# Altium project PAY_IF.PrjPcb (part 3 of 3)

## Sheet RS422.SchDoc
size 420 x 297 mm; SheetNumber: 21; SheetTotal: 23
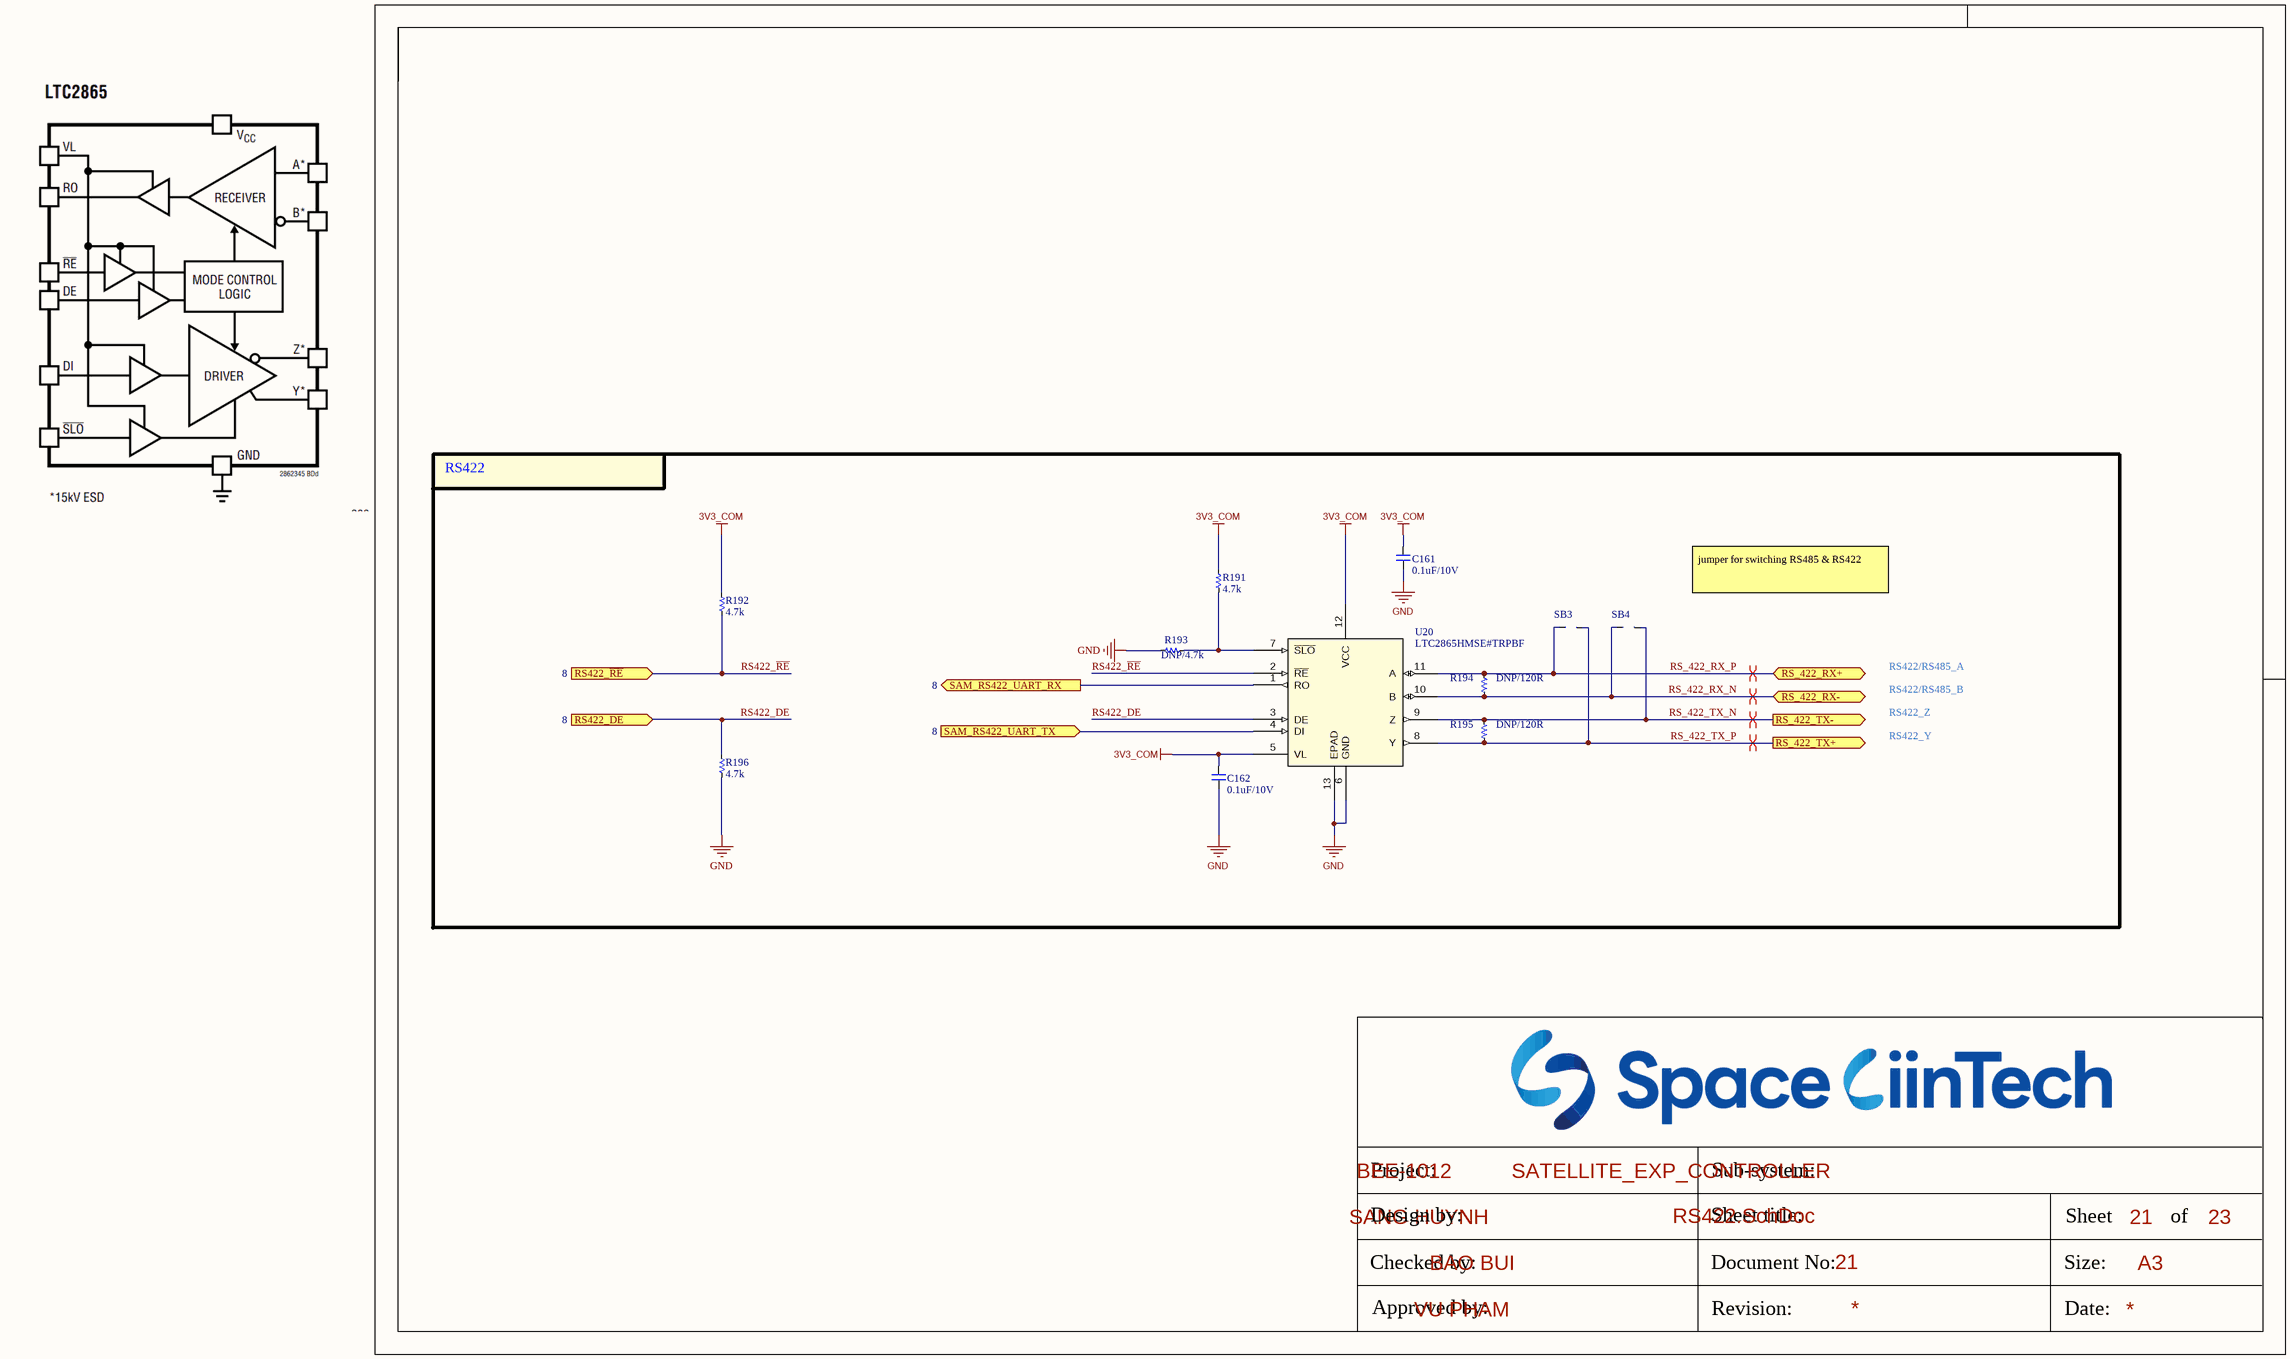
[diagram p24: RS422.SchDoc]

### Parts
C161  0.1uF/10V  [CAP_C_1005X50_L]
C162  0.1uF/10V  [CAP_C_1005X50_L]
R191  4.7k  [RES_C_1005x30_L]
R192  4.7k  [RES_C_1005x30_L]
R193  DNP/4.7k  [RES_C_1005x30_L]
R194  DNP/120R  [RES_C_1005x30_L]
R195  DNP/120R  [RES_C_1005x30_L]
R196  4.7k  [RES_C_1005x30_L]
SB3  JUMPER  [JUMPER_1608]  (value not drawn)
SB4  JUMPER  [JUMPER_1608]  (value not drawn)
U20  LTC2865HMSE#TRPBF  [MSOP-12_MSE_LIT]

### Ports
RS422_DE (in, see 8), RS422_~{RE} (in, see 8), RS_422_RX+ (bidir, see 5), RS_422_RX- (bidir, see 5), RS_422_TX+ (out, see 5), RS_422_TX- (out, see 5), SAM_RS422_UART_RX (out, see 8), SAM_RS422_UART_TX (in, see 8)

### Nets
3V3_COM: C161.2 C162.2 R191.2 R192.2 U20.5(VL) U20.12(VCC)
GND: C161.1 C162.1 R193.2 R196.1 U20.6(GND) U20.13(EPAD)
FLEXCOM3_UART_RX: U20.1(RO) ; port SAM_RS422_UART_RX
FLEXCOM3_UART_TX: U20.4(DI) ; port SAM_RS422_UART_TX
RS422_DE: R196.2 U20.3(DE) ; port RS422_DE
RS422_~{RE}: R192.1 U20.2(~{RE}) ; port RS422_~{RE}
RS_422_RX_N: R194.2 SB4.1 U20.10(B) ; port RS_422_RX-
RS_422_RX_P: R194.1 SB3.1 U20.11(A) ; port RS_422_RX+
RS_422_TX_N: R195.1 SB4.2 U20.9(Z) ; port RS_422_TX-
RS_422_TX_P: R195.2 SB3.2 U20.8(Y) ; port RS_422_TX+
NetR191_1: R191.1 R193.1 U20.7(~{SLO})

### Layout directives
differential pair: RS_422_RX_N, RS_422_RX_P, RS_422_TX_N, RS_422_TX_P

### Notes on the sheet
- RS422
- jumper for switching RS485 & RS422
- RS422/RS485_A
- RS422/RS485_B
- RS422_Z
- RS422_Y
- Project:
- BEE-1012
- Sub-system:
- SATELLITE_EXP_CONTROLLER
- Design by:
- SANG HUYNH
- BAO BUI
- Sheet title:
- Sheet
- A3
- of
- Checked by:
- Approved by:
- VU PHAM
- Revision:
- Document No:
- Size:
- Date:

### Library data of the parts
C161 C162 = _CAP_C_2: CAP CHIP
R191-R196 = _RES_B_2: RES
U20 = LTC2865HMSETRPBF: Â±60V Fault Protected 3V to 5.5V RS485/RS422 Transceivers; Manufacturer_Name: Analog Devices Inc; Copyright: Copyright (C) 2025 Ultra Librarian. All rights reserved.; Manufacturer_Part_Number: LTC2865HMSE#TRPBF; RefDes: RefDes; Type: Type

## Sheet BUTTON_LED.SchDoc
size 420 x 297 mm; SheetNumber: 22; SheetTotal: 23
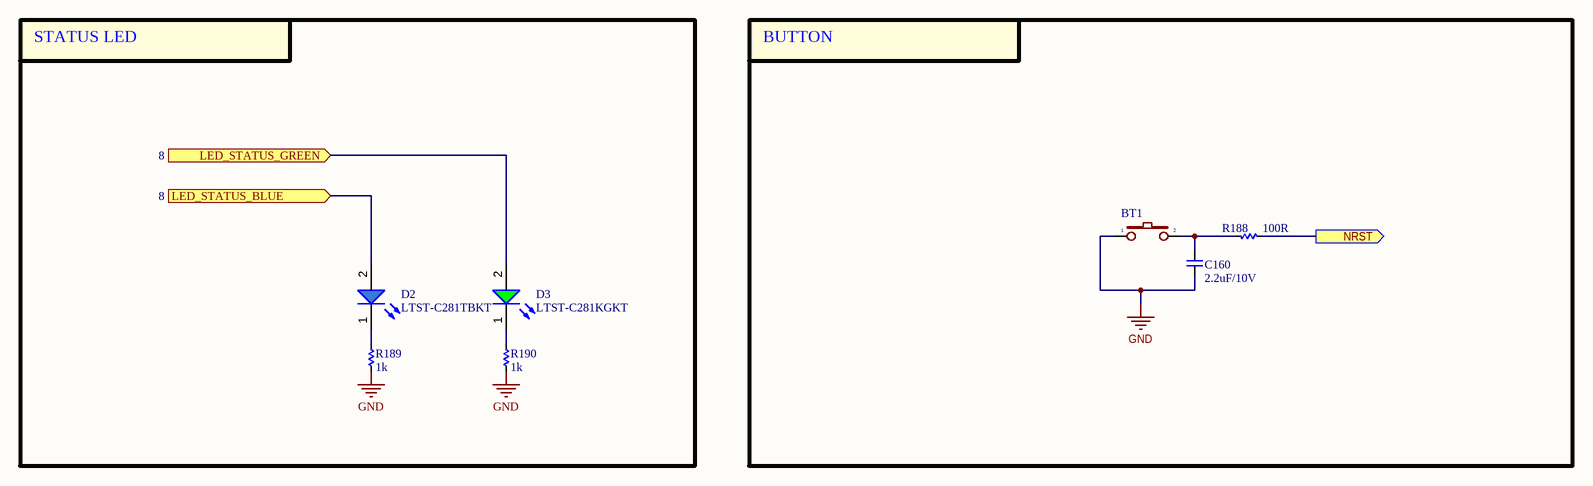
[diagram p25: BUTTON_LED.SchDoc]

### Parts
BT1  BT_  [SW2-SMD]  (value not drawn)
C160  2.2uF/10V  [CAP_C_1005X50_L]
D2  LTST-C281TBKT  [LED_0402]
D3  LTST-C281KGKT  [LED_0402]
R188  100R  [RES_C_1005x30_L]
R189  1k  [RES_C_1005x30_L]
R190  1k  [RES_C_1005x30_L]

### Blocks framed on the sheet
STATUS LED: D2 D3 R189 R190
BUTTON: BT1 C160 R188

### Ports
LED_STATUS_BLUE (in, see 8), LED_STATUS_GREEN (in, see 8), NRST (out, see 6, 7, 17)

### Nets
GND: BT1.1 C160.1 R189.1 R190.1
NRST: R188.2 ; port NRST
NetBT1_2: BT1.2 C160.2 R188.1
NetD2_1: D2.1(K) R189.2
NetD2_2: D2.2(A) ; port LED_STATUS_BLUE
NetD3_1: D3.1(K) R190.2
NetD3_2: D3.2(A) ; port LED_STATUS_GREEN

### Notes on the sheet
- Project:
- BEE-1012
- Sub-system:
- SATELLITE_EXP_CONTROLLER
- Design by:
- SANG HUYNH
- BAO BUI
- Sheet title:
- Sheet
- A3
- of
- Checked by:
- Approved by:
- VU PHAM
- Revision:
- Document No:
- Size:
- Date:

### Library data of the parts
BT1 = BT2: Switch button 2 pin; Value: SW chip 2 pin
C160 = _CAP_C_2: CAP CHIP
D2 = LED_BLUE
D3 = LED_GREEN: LED GREEN CLEAR 0402 SMD
R188-R190 = _RES_B_2: RES

## Sheet MOUNTING_HOLE.SchDoc
size 420 x 297 mm; SheetNumber: 23; SheetTotal: 23
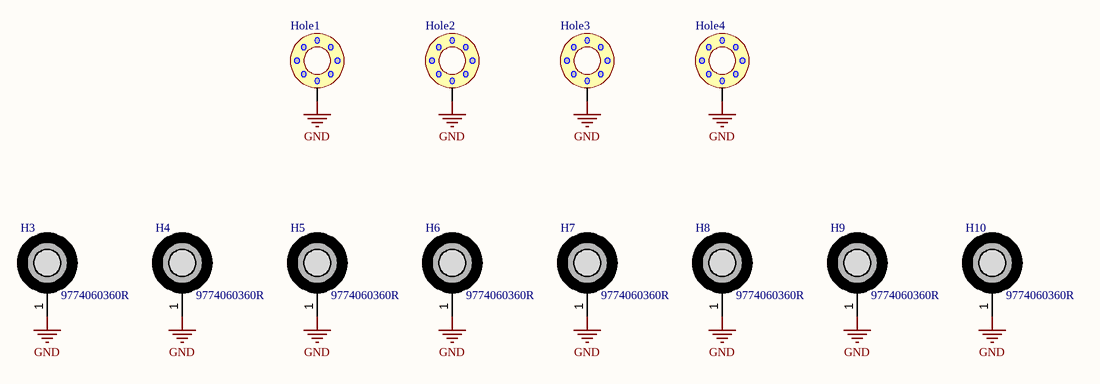
[diagram p26: MOUNTING_HOLE.SchDoc]

### Parts
H3  9774060360R  [M4.4]
H4  9774060360R  [M4.4]
H5  9774060360R  [M4.4]
H6  9774060360R  [M4.4]
H7  9774060360R  [M4.4]
H8  9774060360R  [M4.4]
H9  9774060360R  [M4.4]
H10  9774060360R  [M4.4]
Hole1  hole_space  [HEX-M3_NoVia]  (value not drawn)
Hole2  hole_space  [HEX-M3_NoVia]  (value not drawn)
Hole3  hole_space  [HEX-M3_NoVia]  (value not drawn)
Hole4  hole_space  [HEX-M3_NoVia]  (value not drawn)

### Nets
GND: H3.1 H4.1 H5.1 H6.1 H7.1 H8.1 H9.1 H10.1 Hole1.1 Hole2.1 Hole3.1 Hole4.1

### Notes on the sheet
- Project:
- BEE-1012
- Sub-system:
- SATELLITE_EXP_CONTROLLER
- Design by:
- SANG HUYNH
- BAO BUI
- Sheet title:
- Sheet
- A3
- of
- Checked by:
- Approved by:
- VU PHAM
- Revision:
- Document No:
- Size:
- Date:

### Library data of the parts
H3-H10 = M4.4: WA-SMSI SMT Steel Spacer with / internal Thread

## Nets that join several sheets
3.3_VBAT: Power (C176.1 J11#1.1), SAMA7D65_MPU (R28.1), RTC (C144.2 U12.9)
3V3: SAMA7D65_PMIC (14 pins), SAMA7D65_MPU (19 pins), SAMA7D65_PIO (6 pins), SDCARD (14 pins), EEPROM (C134.2 C135.2 R157.1 U7.8), USB_SWITCH (C163.2 C164.2 R197.2 U21.4), DEBUG_CONSOLE (C136.2 J10.1 R159.1 R160.1), TEMP (C137.2 U9.1), RTC (7 pins), WATCHDOG (C145.2 U13.1)
3V3_COM: Power (C178.2 R212.2 VR1.2 VR1.4), CONNECTOR_INTERFACE (7 pins), LVDS (12 pins), CAN_PHY (6 pins), RS422 (6 pins)
3V3_eMMC: Power (C179.2 R213.2 VR2.2 VR2.4), SAMA7D65_MPU (C45.2 C46.2 U3#2.F9 U3#2.W17), eMMC (72 pins)
5V: Power (10 pins), SAMA7D65_PMIC (13 pins)
12V_CONN: Power (8 pins), CONNECTOR_EXP (J2-2.1 J2-2.2 J2-2.3)
GND: Power (36 pins), CONNECTOR_EXP (7 pins), CONNECTOR_INTERFACE (27 pins), SAMA7D65_PMIC (27 pins), SAMA7D65_MPU (99 pins), SAMA7D65_PIO (C139.1 J2.3 R124.2), SAMA7D65_DDR3L (85 pins), SDCARD (11 pins), eMMC (60 pins), EEPROM (C134.1 C135.1 U7.4), USB_SWITCH (6 pins), DEBUG_CONSOLE (12 pins), TEMP (C137.1 C138.1 U9.3), RTC (C143.1 C144.1 U12.6), WATCHDOG (C145.1 R170.2 R171.2 U13.2), LVDS (12 pins), CAN_PHY (10 pins), RS422 (6 pins), BUTTON_LED (BT1.1 C160.1 R189.1 R190.1), MOUNTING_HOLE (12 pins)
VDDBU: SAMA7D65_PMIC (R6.2), SAMA7D65_MPU (C59.2 R21.2 R28.2 U3#2.E8)
VDDCORE: SAMA7D65_PMIC (R16#2.2 TP6.0), SAMA7D65_MPU (30 pins)
VDDCPU: SAMA7D65_PMIC (R17.2 TP7.0), SAMA7D65_MPU (11 pins)
VDDIODDR: SAMA7D65_PMIC (R15#2.2 TP4.0), SAMA7D65_DDR3L (73 pins)
ADC_TEMP_1: SAMA7D65_PIO (R90.2), TEMP (C138.2 R161.2)
CAN_A7_H: CONNECTOR_EXP (J2-2.9), CONNECTOR_INTERFACE (H1.03 R235.2), CAN_PHY (R178.1 U18.7)
CAN_A7_L: CONNECTOR_EXP (J2-2.8), CONNECTOR_INTERFACE (H1.01 R234.2), CAN_PHY (R180.2 U18.6)
CAN_AX_H: CONNECTOR_INTERFACE (J12.07 R235.1), CAN_PHY (R184.1 U19.7)
CAN_AX_L: CONNECTOR_INTERFACE (J12.08 R234.1), CAN_PHY (R186.2 U19.6)
EXP_2_CONN_USB_N: CONNECTOR_EXP (R119.2), CONNECTOR_INTERFACE (R236.1)
EXP_2_CONN_USB_P: CONNECTOR_EXP (R118.2), CONNECTOR_INTERFACE (R237.1)
EXP_2_IF_USB_N: CONNECTOR_EXP (R117.2), SAMA7D65_MPU (U3#2.G1)
EXP_2_IF_USB_P: CONNECTOR_EXP (R116.2), SAMA7D65_MPU (U3#2.G2)
FLEXCOM1_I2C_SCL: CONNECTOR_EXP (J2-1.6), CONNECTOR_INTERFACE (R231.2 R241.1), SAMA7D65_PIO (R43.2 R83.2)
FLEXCOM1_I2C_SDA: CONNECTOR_EXP (J2-1.5), CONNECTOR_INTERFACE (R229.2 R238.1), SAMA7D65_PIO (R36.2 R84.2)
FLEXCOM2_SPI_CLK: SAMA7D65_PIO (R121.2), LVDS (U17.5)
FLEXCOM2_SPI_MISO: SAMA7D65_PIO (R123.2), LVDS (U16.5)
FLEXCOM3_UART_RX: SAMA7D65_PIO (R63.2), RS422 (U20.1)
FLEXCOM3_UART_TX: SAMA7D65_PIO (R65.2), RS422 (U20.4)
FLEXCOM4_I2C_SCL: CONNECTOR_INTERFACE (J12.05 R45.1), SAMA7D65_PIO (R56.2)
FLEXCOM4_I2C_SDA: CONNECTOR_INTERFACE (J12.06 R47.1), SAMA7D65_PIO (R58.2)
FLEXCOM5_I2C_SCL: CONNECTOR_INTERFACE (R230.1), SAMA7D65_PIO (R57.2 R97.2)
FLEXCOM5_I2C_SDA: CONNECTOR_INTERFACE (R228.1), SAMA7D65_PIO (R54.2 R95.2)
FLEXCOM6_UART_RX: CONNECTOR_INTERFACE (J14#1.14 R226.1), SAMA7D65_PIO (R92.2)
FLEXCOM6_UART_TX: CONNECTOR_INTERFACE (J14#1.15 R94.1), SAMA7D65_PIO (R72.2)
FLEXCOM7_UART_RX: CONNECTOR_INTERFACE (J14#1.11), SAMA7D65_PIO (R86.2)
FLEXCOM7_UART_TX: CONNECTOR_INTERFACE (J14#1.12), SAMA7D65_PIO (R85.2)
FLEXCOM8_SPI_CK: SAMA7D65_PIO (R33.2), LVDS (U15.5)
FLEXCOM8_SPI_MOSI: SAMA7D65_PIO (R73.2), LVDS (U14.5)
FLEXCOM9_UART_RX_DEBUG: SAMA7D65_PIO (R82.2), DEBUG_CONSOLE (J10.3 R160.2)
FLEXCOM9_UART_TX_DEBUG: SAMA7D65_PIO (R80.2), DEBUG_CONSOLE (J10.2 R159.2)
FLEXCOM10_I2C_SCL: SAMA7D65_PMIC (R5.2 U1.6 U2.4), SAMA7D65_PIO (R42.2), RTC (R51.2 U12.4)
FLEXCOM10_I2C_SDA: SAMA7D65_PMIC (R4.2 U1.5 U2.5), SAMA7D65_PIO (R40.2), RTC (R52.2 U12.5)
HPM_MCP16502: SAMA7D65_PMIC (R2.1), SAMA7D65_PIO (R69.2 R122.2 R124.1)
IF_2_SW_USB_N: SAMA7D65_MPU (U3#2.F1), USB_SWITCH (U21.3)
IF_2_SW_USB_P: SAMA7D65_MPU (U3#2.F2), USB_SWITCH (U21.2)
LPM: SAMA7D65_PMIC (R1.1 TP1.0), SAMA7D65_MPU (U3#2.A6)
LVDS_RXC_N: CONNECTOR_INTERFACE (J5.9), LVDS (R175.2 U17.4)
LVDS_RXC_P: CONNECTOR_INTERFACE (J5.8), LVDS (R175.1 U17.3)
LVDS_RXD_N: CONNECTOR_INTERFACE (J5.4), LVDS (R174.2 U16.4)
LVDS_RXD_P: CONNECTOR_INTERFACE (J5.3), LVDS (R174.1 U16.3)
LVDS_TXC_N: CONNECTOR_INTERFACE (J5.7), LVDS (R173.2 U15.3)
LVDS_TXC_P: CONNECTOR_INTERFACE (J5.6), LVDS (R173.1 U15.4)
LVDS_TXD_N: CONNECTOR_INTERFACE (J5.2), LVDS (R172.2 U14.3)
LVDS_TXD_P: CONNECTOR_INTERFACE (J5.1), LVDS (R172.1 U14.4)
MRAM_QSPI_CLK: SAMA7D65_PIO (U3#2.N14), EEPROM (U7.6)
MRAM_QSPI_CS: SAMA7D65_PIO (U3#2.P18), EEPROM (R157.2 U7.1)
MRAM_QSPI_D0: SAMA7D65_PIO (U3#2.R19), EEPROM (U7.5)
MRAM_QSPI_D1: SAMA7D65_PIO (U3#2.P17), EEPROM (U7.2)
MRAM_QSPI_D2: SAMA7D65_PIO (U3#2.R18), EEPROM (U7.3)
MRAM_QSPI_D3: SAMA7D65_PIO (U3#2.T19), EEPROM (U7.7)
NetD2_2: SAMA7D65_PIO (R113.2), BUTTON_LED (D2.2)
NetD3_2: SAMA7D65_PIO (R111.2), BUTTON_LED (D3.2)
NetD6#1_1: Power (D6#1.1 R205.1 U22.1), CONNECTOR_EXP (R214.2), CONNECTOR_INTERFACE (D13.1)
NetJ14#1_19: CONNECTOR_INTERFACE (J14#1.19 R227.2), SAMA7D65_PIO (R81.2)
NetR8_1: SAMA7D65_PMIC (R8.1 U1.1), SAMA7D65_PIO (R78.2)
NetR10_1: SAMA7D65_PMIC (R10.1 U2.1), SAMA7D65_PIO (R74.2)
NetR67_2: SAMA7D65_PIO (R67.2), WATCHDOG (R169.2)
NetR87_2: SAMA7D65_PIO (R87.2), CAN_PHY (U18.1)
NetR88_2: Power (R207.1 U22.9), SAMA7D65_PIO (R88.2)
NetR89_2: SAMA7D65_PIO (R89.2), CAN_PHY (U18.4)
NetR91_2: SAMA7D65_PIO (R91.2), CAN_PHY (U19.1)
NetR93_2: SAMA7D65_PIO (R93.2), CAN_PHY (U19.4)
NetR96_2: SAMA7D65_PIO (R96.2), RTC (R164.2 U12.3)
NetR98_2: SAMA7D65_PIO (R98.2), USB_SWITCH (R197.1 U21.15)
NetR99_2: SAMA7D65_PIO (R99.2), USB_SWITCH (R198.2 U21.6)
NetR100_2: SAMA7D65_PIO (R100.2), USB_SWITCH (R199.2 U21.5)
NetR125_2: SAMA7D65_PIO (R125.2), RTC (R165.2 U12.7)
NetR126_2: SAMA7D65_PIO (R126.2), WATCHDOG (R168.2)
NRST: SAMA7D65_PMIC (R7.1 U1.2), SAMA7D65_MPU (C29.1 R18#2.2 U3#2.D3), WATCHDOG (R167#2.2), BUTTON_LED (R188.2)
RS422_DE: SAMA7D65_PIO (R61.2), RS422 (R196.2 U20.3)
RS422_~{RE}: SAMA7D65_PIO (R59.2), RS422 (R192.1 U20.2)
RS_422_RX_N: CONNECTOR_INTERFACE (R77.1 R177.2), RS422 (R194.2 SB4.1 U20.10)
RS_422_RX_P: CONNECTOR_INTERFACE (R109.1 R182.2), RS422 (R194.1 SB3.1 U20.11)
RS_422_TX_N: CONNECTOR_INTERFACE (R75.1 R176.2), RS422 (R195.1 SB4.2 U20.9)
RS_422_TX_P: CONNECTOR_INTERFACE (R53.1 R120.2), RS422 (R195.2 SB3.2 U20.8)
SDMMC0_CLK: SAMA7D65_PIO (R31.2), eMMC (R140.2 U5.P6)
SDMMC0_CMD: SAMA7D65_PIO (R32.2), eMMC (R141.2 U5.P5)
SDMMC0_D0: SAMA7D65_PIO (R35.2), eMMC (R132.2 U5.K2)
SDMMC0_D1: SAMA7D65_PIO (R37.2), eMMC (R133.2 U5.N2)
SDMMC0_D2: SAMA7D65_PIO (R46.2), eMMC (R134.2 U5.K3)
SDMMC0_D3: SAMA7D65_PIO (R48.2), eMMC (R135.2 U5.N3)
SDMMC0_D4: SAMA7D65_PIO (R38.2), eMMC (R136.2 U5.N8)
SDMMC0_D5: SAMA7D65_PIO (R39.2), eMMC (R137.2 U5.K8)
SDMMC0_D6: SAMA7D65_PIO (R41.2), eMMC (R138.2 U5.N9)
SDMMC0_D7: SAMA7D65_PIO (R44.2), eMMC (R139.2 U5.K9)
SDMMC0_DS: SAMA7D65_PIO (R50.2), eMMC (U5.K5)
SDMMC0_NRST: SAMA7D65_PIO (R34.2), eMMC (R142.2 U5.M5)
SDMMC1_CLK: SAMA7D65_PIO (R64.2), eMMC (R147.2 U6.P6)
SDMMC1_CMD: SAMA7D65_PIO (R62.2), eMMC (R148.2 U6.P5)
SDMMC1_D0: SAMA7D65_PIO (R66.2), eMMC (R143.2 U6.K2)
SDMMC1_D1: SAMA7D65_PIO (R68.2), eMMC (R144.2 U6.N2)
SDMMC1_D2: SAMA7D65_PIO (R70.2), eMMC (R145.2 U6.K3)
SDMMC1_D3: SAMA7D65_PIO (R71.2), eMMC (R146.2 U6.N3)
SDMMC1_NRST: SAMA7D65_PIO (R60.2), eMMC (R149.2 U6.M5)
SDMMC2_CD: SAMA7D65_PIO (R79.2), SDCARD (J7.P9 R156.1)
SDMMC2_CK: SAMA7D65_PIO (R107.2), SDCARD (CR1.3 J7.P5 R154.1)
SDMMC2_CMD: SAMA7D65_PIO (R106.2), SDCARD (CR2.6 J7.P3 R155.1)
SDMMC2_D0: SAMA7D65_PIO (R108.2), SDCARD (CR1.4 J7.P7 R150.1)
SDMMC2_D1: SAMA7D65_PIO (R110.2), SDCARD (CR1.6 J7.P8 R151.1)
SDMMC2_D2: SAMA7D65_PIO (R112.2), SDCARD (CR2.3 J7.P1 R152.1)
SDMMC2_D3: SAMA7D65_PIO (R76.2), SDCARD (CR2.4 J7.P2 R153.1)
SHDN: SAMA7D65_PMIC (R3.1), SAMA7D65_MPU (U3#2.B4)
SPI_CLK_EXP: CONNECTOR_EXP (J2-1.4), CONNECTOR_INTERFACE (R221.1 R240.1)
SPI_CS_EXP: CONNECTOR_EXP (J2-1.2), CONNECTOR_INTERFACE (R220.1 R239.1)
SPI_MISO_EXP: CONNECTOR_EXP (J2-1.3), CONNECTOR_INTERFACE (R223.1 R243.1)
SPI_MOSI_EXP: CONNECTOR_EXP (J2-1.1), CONNECTOR_INTERFACE (R222.1 R242.1)
STX_GPIO: CONNECTOR_INTERFACE (R215.2), SAMA7D65_PIO (R55.2)
SW_2_CONN_USB_N: CONNECTOR_INTERFACE (R114.1), USB_SWITCH (U21.11)
SW_2_CONN_USB_P: CONNECTOR_INTERFACE (R115.1), USB_SWITCH (U21.12)
USB_DEBUG_N: USB_SWITCH (U21.14), DEBUG_CONSOLE (J9.2)
USB_DEBUG_P: USB_SWITCH (U21.13), DEBUG_CONSOLE (J9.3)
WKUP: SAMA7D65_PMIC (R6.1 U1.7), SAMA7D65_MPU (U3#2.A8)